# Altium schematic sheet LTC2949.SchDoc
size A
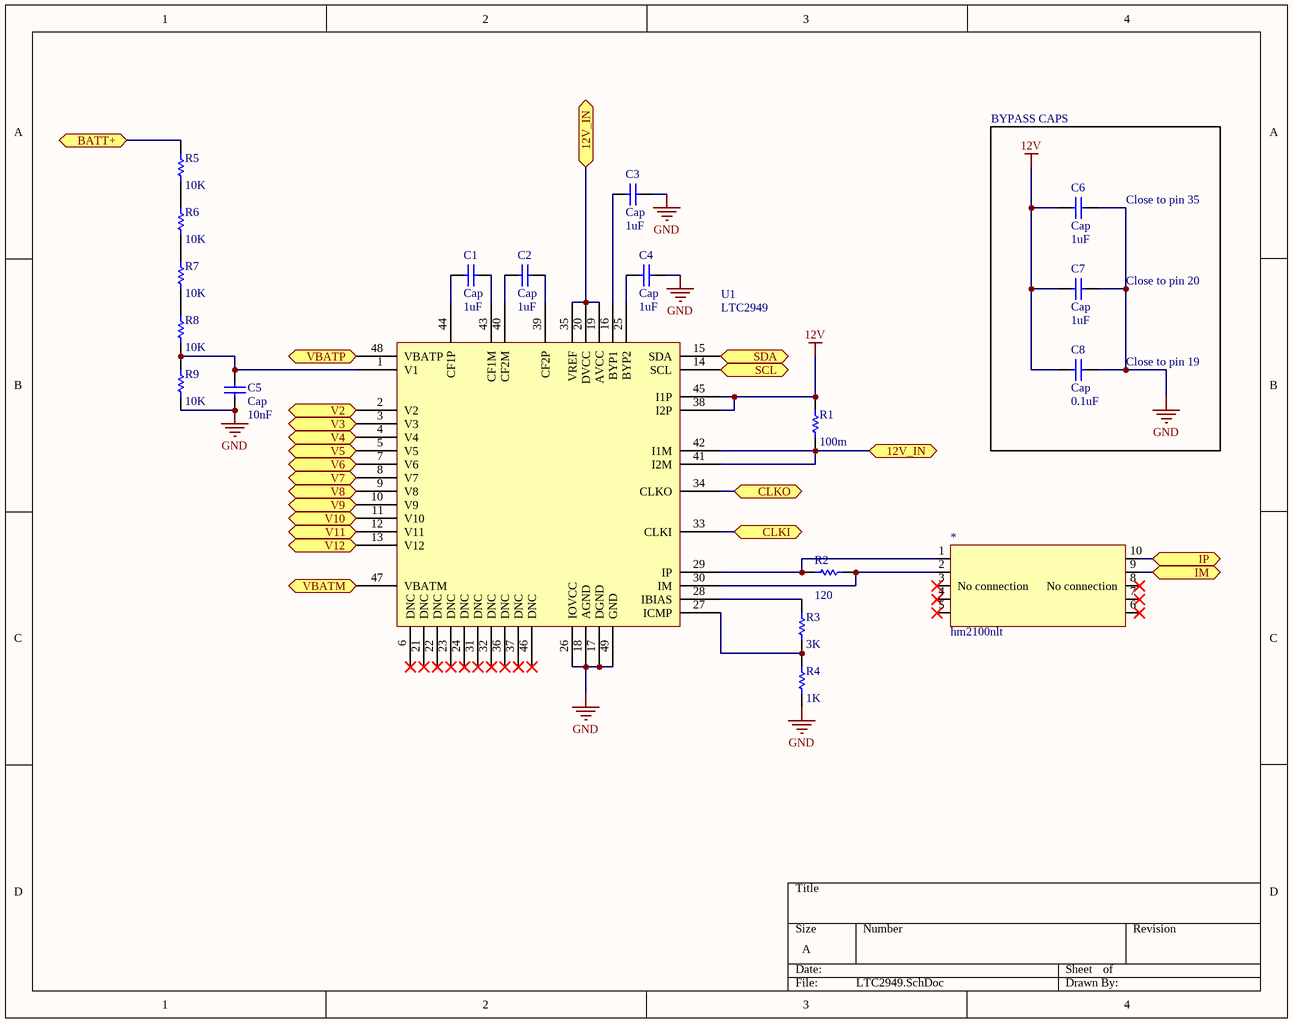
[diagram p0: LTC2949.SchDoc]

## Parts
*  hm2100nlt
C1  Cap  value 1uF  [RAD-0.3]
C2  Cap  value 1uF  [RAD-0.3]
C3  Cap  value 1uF  [RAD-0.3]
C4  Cap  value 1uF  [RAD-0.3]
C5  Cap  value 10nF  [RAD-0.3]
C6  Cap  value 1uF  [RAD-0.3]
C7  Cap  value 1uF  [RAD-0.3]
C8  Cap  value 0.1uF  [RAD-0.3]
R1  value 100m  [AXIAL-0.3]  (hidden comment: Res1)
R2  value 120  [AXIAL-0.3]  (hidden comment: 1%)
R3  value 3K  [AXIAL-0.3]  (hidden comment: 1%)
R4  value 1K  [AXIAL-0.3]  (hidden comment: 1%)
R5  value 10K  [AXIAL-0.3]  (hidden comment: Res1)
R6  value 10K  [AXIAL-0.3]  (hidden comment: Res1)
R7  value 10K  [AXIAL-0.3]  (hidden comment: Res1)
R8  value 10K  [AXIAL-0.3]  (hidden comment: Res1)
R9  value 10K  [AXIAL-0.3]  (hidden comment: Res1)
U1  LTC2949

## Ports
12V_IN (bidir), BATT+ (bidir), CLKI (bidir), CLKO (bidir), IM (bidir), IP (bidir), SCL (bidir), SDA (bidir), V2 (bidir), V3 (bidir), V4 (bidir), V5 (bidir), V6 (bidir), V7 (bidir), V8 (bidir), V9 (bidir), V10 (bidir), V11 (bidir), V12 (bidir), VBATM (bidir), VBATP (bidir)

## Nets
12V: C6.1 C7.1 C8.1 R1.2 U1.38(I2P) U1.45(I1P)
GND: C3.2 C4.2 C5.1 C6.2 C7.2 C8.2 R4.2 R9.1 U1.17(DGND) U1.18(AGND) U1.26(IOVCC) U1.49(GND)
12V_IN: R1.1 U1.19(AVCC) U1.20(DVCC) U1.35(VREF) U1.41(I2M) U1.42(I1M) ; port 12V_IN
BATT+: R5.2 ; port BATT+
CLKI: U1.33(CLKI) ; port CLKI
CLKO: U1.34(CLKO) ; port CLKO
IM: *.9 ; port IM
IP: *.10 ; port IP
SCL: U1.14(SCL) ; port SCL
SDA: U1.15(SDA) ; port SDA
V2: U1.2(V2) ; port V2
V3: U1.3(V3) ; port V3
V4: U1.4(V4) ; port V4
V5: U1.5(V5) ; port V5
V6: U1.7(V6) ; port V6
V7: U1.8(V7) ; port V7
V8: U1.9(V8) ; port V8
V9: U1.10(V9) ; port V9
V10: U1.11(V10) ; port V10
V11: U1.12(V11) ; port V11
V12: U1.13(V12) ; port V12
VBATM: U1.47(VBATM) ; port VBATM
VBATP: U1.48(VBATP) ; port VBATP
Net*_1: *.1 R2.1 U1.29(IP)
Net*_2: *.2 R2.2 U1.30(IM)
NetC1_1: C1.1 U1.44(CF1P)
NetC1_2: C1.2 U1.43(CF1M)
NetC2_1: C2.1 U1.40(CF2M)
NetC2_2: C2.2 U1.39(CF2P)
NetC3_1: C3.1 U1.16(BYP1)
NetC4_1: C4.1 U1.25(BYP2)
NetC5_2: C5.2 R8.1 R9.2 U1.1(V1)
NetR3_1: R3.1 R4.1 U1.27(ICMP)
NetR3_2: R3.2 U1.28(IBIAS)
NetR5_1: R5.1 R6.2
NetR6_1: R6.1 R7.2
NetR7_1: R7.1 R8.2

Not connected (* = marked no-connect by the designer): * 3(No_connection)* 4* 5* 6* 7* 8(No_connection)*; U1 6(DNC)* 21(DNC)* 22(DNC)* 23(DNC)* 24(DNC)* 31(DNC)* 32(DNC)* 36(DNC)* 37(DNC)* 46(DNC)*

## Notes on the sheet
- BYPASS CAPS
- (near C6) Close to pin 35
- (near C7) Close to pin 20
- (near C8) Close to pin 19

## Library data of the parts
C1-C8 = Cap: Capacitor; Published: 8-Jun-2000; LatestRevisionDate: 17-Jul-2002; LatestRevisionNote: Re-released for DXP Platform.; PackageReference: RAD-0.3; Publisher: Altium Limited; PackageDescription: Radial Cap, Thru-Hole; 2 Leads; 0.3 in Pin Spacing
R1-R9 = Res1: Resistor; Published: 8-Jun-2000; LatestRevisionDate: 17-Jul-2002; LatestRevisionNote: Re-released for DXP Platform.; PackageReference: AXIAL-0.3; Publisher: Altium Limited; PackageDescription: Axial Device, Thru-Hole; 2 Leads; 0.3 in Pin Spacing